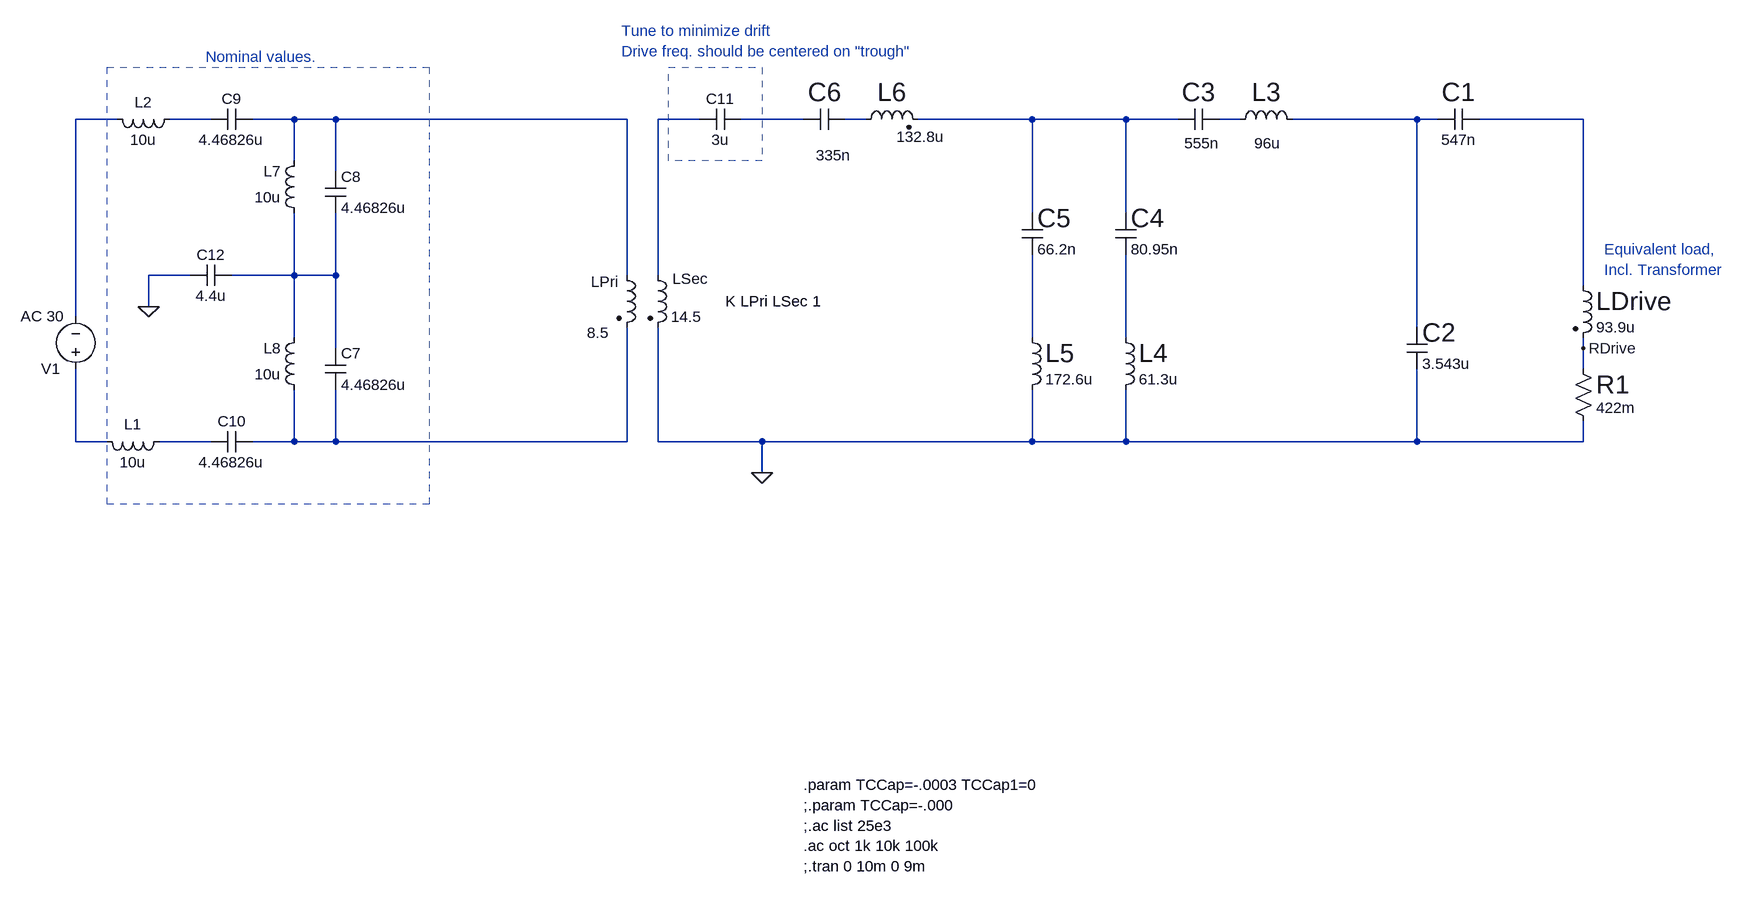
[diagram p0: schematic Tx_Filter_MPS_23,8kHz-Measured.asc]
Tx_Filter_MPS_23,8kHz-Measured.asc, the LTspice schematic file:
Version 4
SHEET 1 2608 1216
WIRE -464 64 -528 64
WIRE -320 64 -384 64
WIRE -192 64 -256 64
WIRE -128 64 -192 64
WIRE 320 64 -128 64
WIRE 432 64 368 64
WIRE 592 64 496 64
WIRE 688 64 656 64
WIRE 944 64 768 64
WIRE 1088 64 944 64
WIRE 1168 64 1088 64
WIRE 1264 64 1232 64
WIRE 1536 64 1344 64
WIRE 1568 64 1536 64
WIRE 1792 64 1632 64
WIRE -192 128 -192 64
WIRE -128 144 -128 64
WIRE 944 208 944 64
WIRE 1088 208 1088 64
WIRE -352 304 -416 304
WIRE -192 304 -192 208
WIRE -192 304 -288 304
WIRE -128 304 -128 208
WIRE -128 304 -192 304
WIRE 320 304 320 64
WIRE 368 304 368 64
WIRE 1792 320 1792 64
WIRE -416 352 -416 304
WIRE -528 368 -528 64
WIRE 1536 384 1536 64
WIRE -192 400 -192 304
WIRE 944 400 944 272
WIRE 1088 400 1088 272
WIRE -128 416 -128 304
WIRE 1792 416 1792 400
WIRE 1792 448 1792 416
WIRE -528 560 -528 448
WIRE -480 560 -528 560
WIRE -320 560 -400 560
WIRE -192 560 -192 480
WIRE -192 560 -256 560
WIRE -128 560 -128 480
WIRE -128 560 -192 560
WIRE 320 560 320 384
WIRE 320 560 -128 560
WIRE 368 560 368 384
WIRE 528 560 368 560
WIRE 944 560 944 480
WIRE 944 560 528 560
WIRE 1088 560 1088 480
WIRE 1088 560 944 560
WIRE 1536 560 1536 448
WIRE 1536 560 1088 560
WIRE 1792 560 1792 528
WIRE 1792 560 1536 560
WIRE 528 608 528 560
FLAG 528 608 0
FLAG -416 352 0
FLAG 1792 416 RDrive
SYMBOL voltage -528 464 R180
WINDOW 123 18 97 Left 2
WINDOW 3 19 111 Invisible 2
SYMATTR Value2 AC 30
SYMATTR Value SINE(0 1 25e3)
SYMATTR SpiceLine Rser=0
SYMATTR InstName V1
SYMBOL ind2 672 80 R270
WINDOW 0 32 56 VTop 4
WINDOW 3 5 100 VBottom 2
SYMATTR InstName L6
SYMATTR Value 132.8u
SYMATTR SpiceLine Rser=361m
SYMATTR Type ind
SYMBOL cap 656 48 R90
WINDOW 0 0 32 VBottom 4
WINDOW 3 56 18 VTop 2
SYMATTR InstName C6
SYMATTR Value 335n
SYMATTR SpiceLine Rpar=5.56k
SYMBOL ind2 1776 304 R0
WINDOW 0 36 40 Left 4
SYMATTR InstName LDrive
SYMATTR Value 93.9u
SYMATTR Type ind
SYMATTR SpiceLine Rser=0
SYMBOL res 1776 432 R0
WINDOW 0 36 40 Left 4
SYMATTR InstName R1
SYMATTR Value 422m
SYMBOL cap 1632 48 R90
WINDOW 0 0 32 VBottom 4
WINDOW 3 32 32 VTop 2
SYMATTR InstName C1
SYMATTR Value 547n
SYMATTR SpiceLine Rpar=2.4k
SYMBOL cap 1520 384 R0
WINDOW 0 24 8 Left 4
SYMATTR InstName C2
SYMATTR Value 3.543u
SYMATTR SpiceLine Rpar=148
SYMBOL ind2 304 288 R0
WINDOW 0 -39 26 Left 2
WINDOW 3 -45 104 Left 2
SYMATTR InstName LPri
SYMATTR Value 8.5
SYMATTR Type ind
SYMBOL ind2 352 288 R0
WINDOW 0 38 21 Left 2
SYMATTR InstName LSec
SYMATTR Value 14.5
SYMATTR Type ind
SYMBOL ind 1248 80 R270
WINDOW 0 32 56 VTop 4
WINDOW 3 -5 58 VBottom 2
SYMATTR InstName L3
SYMATTR Value 96u
SYMATTR SpiceLine Rser=467m
SYMBOL cap 1232 48 R90
WINDOW 0 0 32 VBottom 4
WINDOW 3 37 27 VTop 2
SYMATTR InstName C3
SYMATTR Value 555n
SYMATTR SpiceLine Rpar=2.7k
SYMBOL ind 1072 384 R0
WINDOW 0 36 40 Left 4
SYMATTR InstName L4
SYMATTR Value 61.3u
SYMATTR SpiceLine Rser=390m
SYMBOL ind 928 384 R0
WINDOW 0 36 40 Left 4
SYMATTR InstName L5
SYMATTR Value 172.6u
SYMATTR SpiceLine Rser=1
SYMBOL cap 1072 208 R0
WINDOW 0 24 8 Left 4
SYMATTR InstName C4
SYMATTR Value 80.95n
SYMATTR SpiceLine Rpar=98k
SYMBOL cap 928 208 R0
WINDOW 0 24 8 Left 4
SYMATTR InstName C5
SYMATTR Value 66.2n
SYMATTR SpiceLine Rpar=280k
SYMBOL ind -384 544 R90
WINDOW 0 5 56 VBottom 2
WINDOW 3 32 56 VTop 2
SYMATTR InstName L1
SYMATTR Value 10u
SYMATTR SpiceLine Rser=50m
SYMBOL ind -368 48 R90
WINDOW 0 5 56 VBottom 2
WINDOW 3 32 56 VTop 2
SYMATTR InstName L2
SYMATTR Value 10u
SYMATTR SpiceLine Rser=50m
SYMBOL cap -144 416 R0
SYMATTR InstName C7
SYMATTR Value 4.46826u
SYMATTR SpiceLine Rpar=300
SYMBOL cap -144 144 R0
SYMATTR InstName C8
SYMATTR Value 4.46826u
SYMATTR SpiceLine Rpar=300
SYMBOL ind -176 224 R180
WINDOW 0 36 80 Left 2
WINDOW 3 36 40 Left 2
SYMATTR InstName L7
SYMATTR Value 10u
SYMATTR SpiceLine Rser=50m
SYMBOL ind -176 496 R180
WINDOW 0 36 80 Left 2
WINDOW 3 36 40 Left 2
SYMATTR InstName L8
SYMATTR Value 10u
SYMATTR SpiceLine Rser=50m
SYMBOL cap -256 48 R90
WINDOW 0 0 32 VBottom 2
WINDOW 3 32 32 VTop 2
SYMATTR InstName C9
SYMATTR Value 4.46826u
SYMATTR SpiceLine Rpar=300
SYMBOL cap -256 544 R90
WINDOW 0 0 32 VBottom 2
WINDOW 3 32 32 VTop 2
SYMATTR InstName C10
SYMATTR Value 4.46826u
SYMATTR SpiceLine Rpar=300
SYMBOL cap -288 288 R90
WINDOW 0 0 32 VBottom 2
WINDOW 3 32 32 VTop 2
SYMATTR InstName C12
SYMATTR Value 4.4u
SYMBOL cap 496 48 R90
WINDOW 0 0 32 VBottom 2
WINDOW 3 32 32 VTop 2
SYMATTR InstName C11
SYMATTR Value 3u
TEXT 592 1088 Left 2 !.param TCCap=-.0003 TCCap1=0\n;.param TCCap=-.000\n;.ac list 25e3\n.ac oct 1k 10k 100k\n;.tran 0 10m 0 9m
TEXT 472 344 Left 2 !K LPri LSec 1
TEXT -328 -32 Left 2 ;Nominal values.
TEXT 1824 264 Left 2 ;Equivalent load,\nIncl. Transformer
TEXT 312 -72 Left 2 ;Tune to minimize drift\nDrive freq. should be centered on "trough"
RECTANGLE Normal 16 656 -480 -16 2
RECTANGLE Normal 528 128 384 -16 2

The netlist it stands for:
* Tx_Filter_MPS_23,8kHz-Measured.asc
V1 N014 N001 SINE(0 1 25e3) AC 30 Rser=0
L6 N006 N007 132.8u Rser=361m
C6 N006 N005 335n Rpar=5.56k
LDrive N010 RDrive 93.9u Rser=0
R1 RDrive 0 422m
C1 N010 N009 547n Rpar=2.4k
C2 N009 0 3.543u Rpar=148
LPri N003 N016 8.5
LSec N004 0 14.5
L3 N008 N009 96u Rser=467m
C3 N008 N007 555n Rpar=2.7k
L4 N013 0 61.3u Rser=390m
L5 N012 0 172.6u Rser=1
C4 N007 N013 80.95n Rpar=98k
C5 N007 N012 66.2n Rpar=280k
L1 N015 N014 10u Rser=50m
L2 N002 N001 10u Rser=50m
C7 N011 N016 4.46826u Rpar=300
C8 N003 N011 4.46826u Rpar=300
L7 N011 N003 10u Rser=50m
L8 N016 N011 10u Rser=50m
C9 N003 N002 4.46826u Rpar=300
C10 N016 N015 4.46826u Rpar=300
C12 N011 0 4.4u
C11 N005 N004 3u
.param TCCap=-.0003 TCCap1=0
;.param TCCap=-.000
;.ac list 25e3
.ac oct 1k 10k 100k
;.tran 0 10m 0 9m
K LPri LSec 1
* Nominal values.
* Equivalent load,
* Incl. Transformer
* Tune to minimize drift
* Drive freq. should be centered on "trough"
.backanno
.end